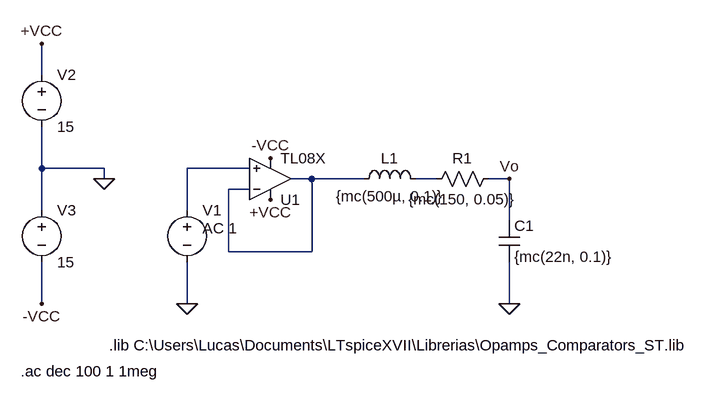
[diagram p0: schematic Pasabajos.asc]
Pasabajos.asc, the LTspice schematic file:
Version 4
SHEET 1 880 680
WIRE -288 -64 -288 -112
WIRE -288 80 -288 16
WIRE -192 80 -288 80
WIRE 32 80 -64 80
WIRE -192 96 -192 80
WIRE 128 96 96 96
WIRE 208 96 128 96
WIRE 320 96 288 96
WIRE 432 96 400 96
WIRE 32 112 0 112
WIRE -288 144 -288 80
WIRE -64 144 -64 80
WIRE 432 160 432 96
WIRE 0 208 0 112
WIRE 128 208 128 96
WIRE 128 208 0 208
WIRE -288 288 -288 224
WIRE -64 288 -64 224
WIRE 432 288 432 224
FLAG -64 288 0
FLAG -192 96 0
FLAG -288 -112 +VCC
FLAG -288 288 -VCC
FLAG 432 288 0
FLAG 432 96 Vo
FLAG 64 128 +VCC
FLAG 64 64 -VCC
SYMBOL voltage -64 128 R0
WINDOW 123 24 44 Left 2
WINDOW 39 0 0 Left 0
WINDOW 3 20 119 Left 2
SYMATTR Value2 AC 1
SYMATTR Value ""
SYMATTR InstName V1
SYMBOL res 304 112 R270
WINDOW 0 32 56 VTop 2
WINDOW 3 0 56 VBottom 2
SYMATTR InstName R1
SYMATTR Value {mc(150, 0.05)}
SYMBOL ind 192 112 R270
WINDOW 0 32 56 VTop 2
WINDOW 3 5 56 VBottom 2
SYMATTR InstName L1
SYMATTR Value {mc(500µ, 0.1)}
SYMBOL cap 416 160 R0
SYMATTR InstName C1
SYMATTR Value {mc(22n, 0.1)}
SYMBOL voltage -288 -80 R0
WINDOW 123 0 0 Left 0
WINDOW 39 0 0 Left 0
SYMATTR InstName V2
SYMATTR Value 15
SYMBOL voltage -288 128 R0
WINDOW 123 0 0 Left 0
WINDOW 39 0 0 Left 0
SYMATTR InstName V3
SYMATTR Value 15
SYMBOL Opamps\\opamp2 64 160 M180
SYMATTR InstName U1
SYMATTR Value TL08X
TEXT -184 352 Left 2 !.lib C:\\Users\\Lucas\\Documents\\LTspiceXVII\\Librerias\\Opamps_Comparators_ST.lib
TEXT -320 392 Left 2 !.ac dec 100 1 1meg

The netlist it stands for:
* Pasabajos.asc
V1 N001 0 AC 1
R1 N003 Vo {mc(150, 0.05)}
L1 N002 N003 {mc(500µ, 0.1)}
C1 Vo 0 {mc(22n, 0.1)}
V2 +VCC 0 15
V3 0 -VCC 15
XU1 N001 N002 +VCC -VCC N002 TL08X  ; pins In+ In- V+ V- OUT
.lib C:\Users\Lucas\Documents\LTspiceXVII\Librerias\Opamps_Comparators_ST.lib
.ac dec 100 1 1meg
.backanno
.end